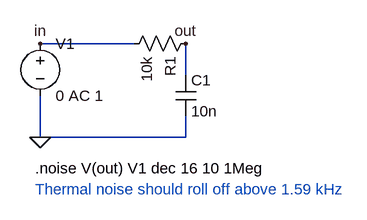
[diagram p0: schematic 07_noise_rc_lowpass.asc]
07_noise_rc_lowpass.asc, the LTspice schematic file:
Version 4
SHEET 1 880 680
WIRE 80 96 224 96
WIRE 304 96 304 144
WIRE 304 208 304 240
WIRE 80 176 80 240
WIRE 80 240 304 240
FLAG 80 240 0
FLAG 80 96 in
FLAG 304 96 out
SYMBOL voltage 80 80 R0
SYMATTR InstName V1
SYMATTR Value 0 AC 1
SYMBOL res 320 80 R90
SYMATTR InstName R1
SYMATTR Value 10k
SYMBOL cap 288 144 R0
SYMATTR InstName C1
SYMATTR Value 10n
TEXT 72 288 Left 2 !.noise V(out) V1 dec 16 10 1Meg
TEXT 72 320 Left 2 ;Thermal noise should roll off above 1.59 kHz

The netlist it stands for:
* 07_noise_rc_lowpass.asc
V1 in 0 0 AC 1
R1 out in 10k
C1 out 0 10n
.noise V(out) V1 dec 16 10 1Meg
* Thermal noise should roll off above 1.59 kHz
.backanno
.end